# Altium schematic sheet 4.7uF SCH.schdoc
size 41 x 30 mm
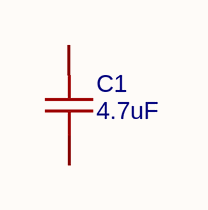
[diagram p0: 4.7uF SCH.schdoc]

## Parts
C1  4.7uF  [C0402]

## Nets

Not connected (* = marked no-connect by the designer): C1 1 2

## Library data of the parts
C1 = 4.7uF: CAP CER 4.7UF 16V X5R 0402; Manufacturer: SAMSUNG(三星); Manufacturer Part: CL05A475MO5NUNC; nameAlias: Value; Contributor: LCSC; Supplier: LCSC; Supplier Part: C318563; JLCPCB Part Class: Extended Part; spicePre: C; spiceSymbolName: CL05A475MO5NUNC; LCSC Part Number: C318563